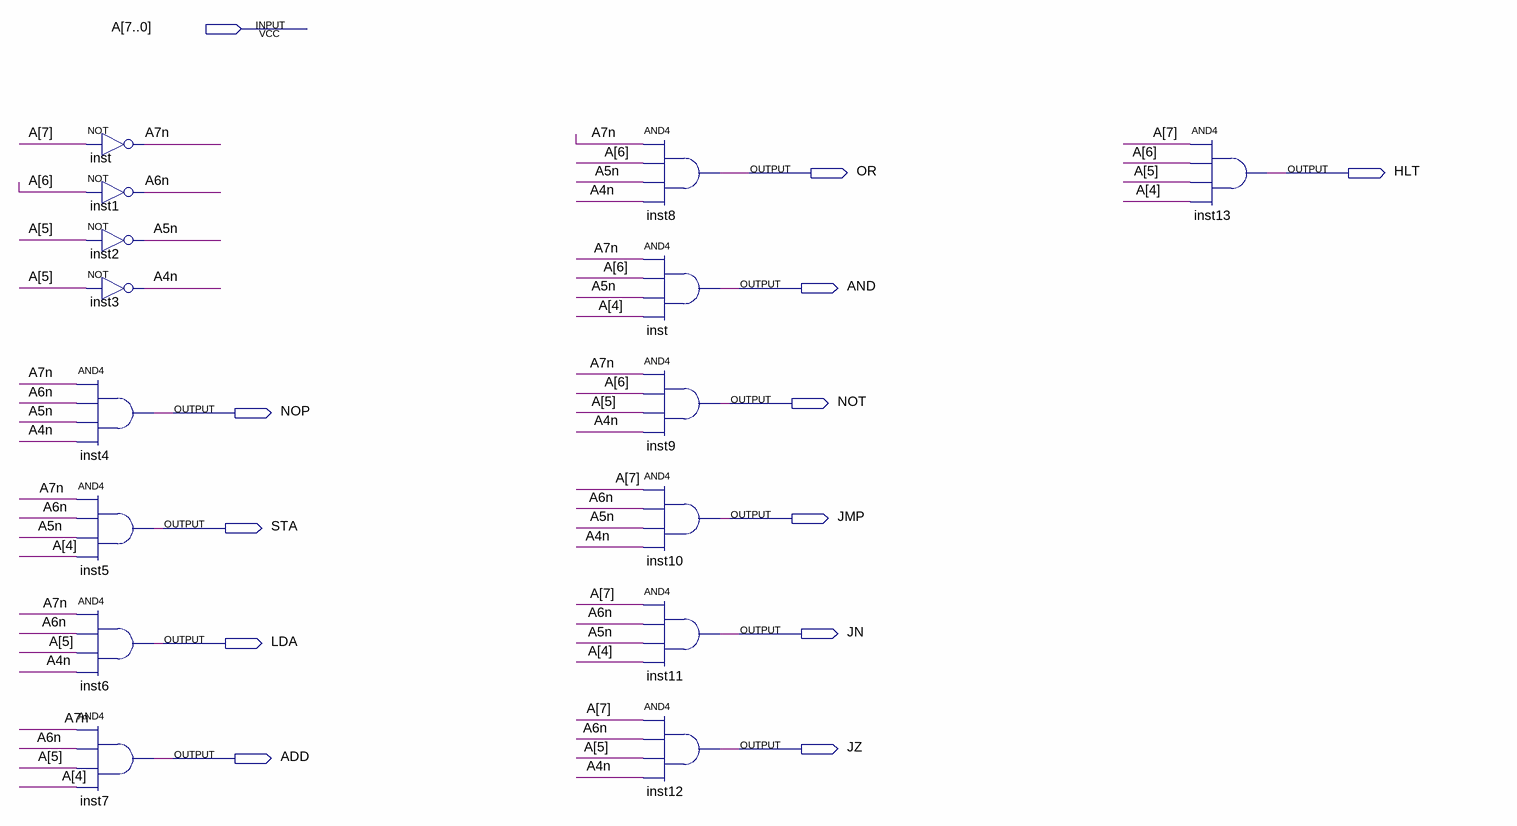
[diagram p0: schematic sheet]
// Quartus schematic Decoder.bdf as structural Verilog: 15 symbols, 12 pins
module Decoder (
  input  [7:0] A,
  output OR,
  output HLT,
  output AND,
  output NOT,
  output NOP,
  output JMP,
  output STA,
  output JN,
  output LDA,
  output JZ,
  output ADD
);

  wire A4n, A5n, A6n, A7n;

  not inst (A7n, A[7]);
  not inst1 (A6n, A[6]);
  not inst2 (A5n, A[5]);
  not inst3 (A4n, A[5]);
  and inst4 (NOP, A7n, A6n, A5n, A4n);
  and inst5 (STA, A7n, A6n, A5n, A[4]);
  and inst6 (LDA, A7n, A6n, A[5], A4n);
  and inst7 (ADD, A7n, A6n, A[5], A[4]);
  and inst8 (OR, A7n, A[6], A5n, A4n);
  and inst_dup2 (AND, A7n, A[6], A5n, A[4]);
  and inst9 (NOT, A7n, A[6], A[5], A4n);
  and inst10 (JMP, A[7], A6n, A5n, A4n);
  and inst11 (JN, A[7], A6n, A5n, A[4]);
  and inst12 (JZ, A[7], A6n, A[5], A4n);
  and inst13 (HLT, A[7], A[6], A[5], A[4]);
endmodule
